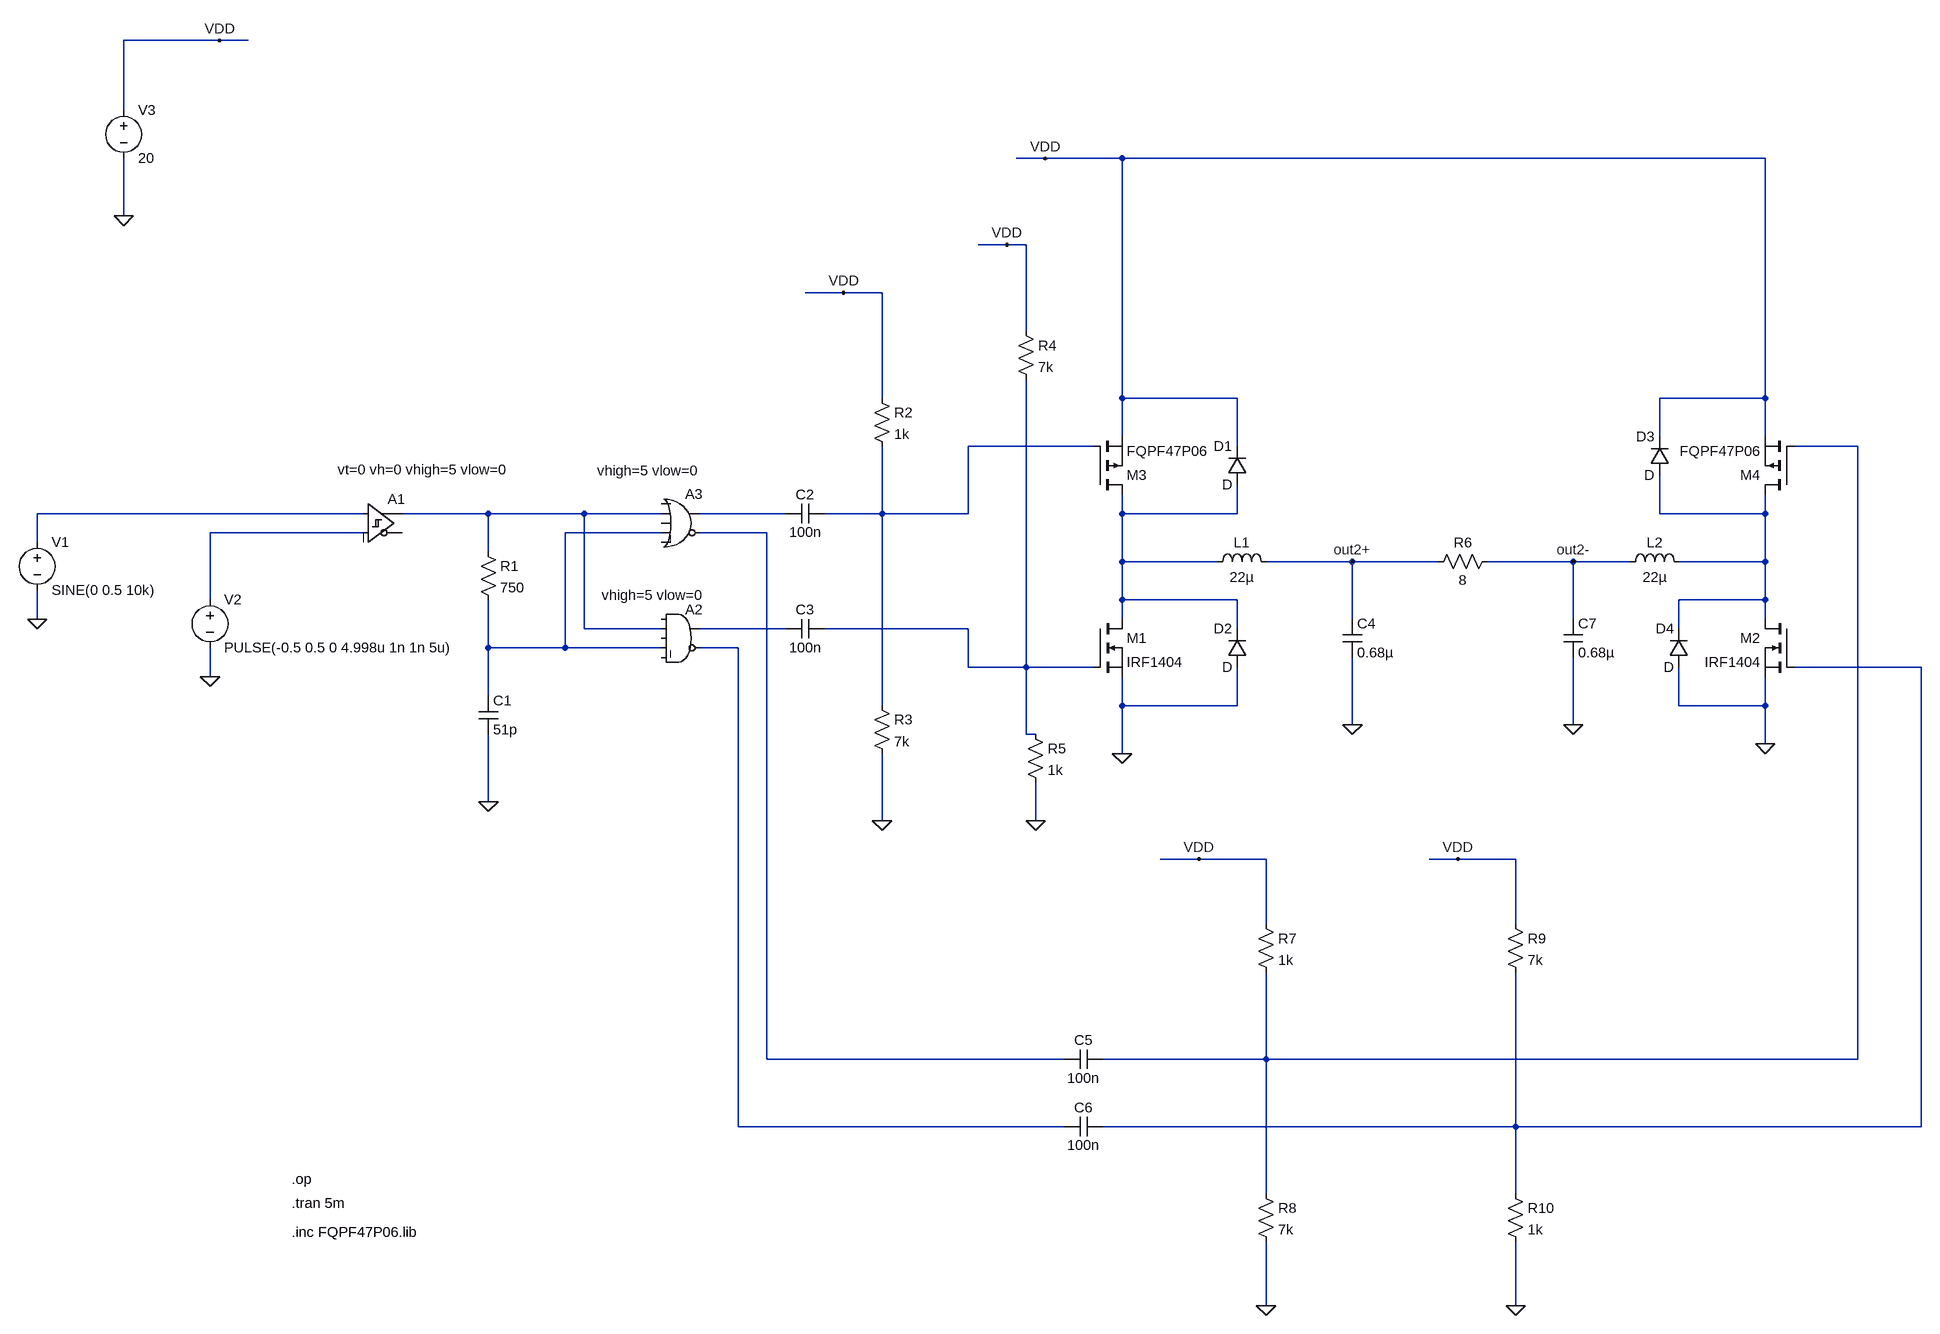
[diagram p0: schematic ClassDAmplifierAlt.asc]
ClassDAmplifierAlt.asc, the LTspice schematic file:
Version 4
SHEET 1 880 1428
WIRE -2784 -864 -2944 -864
WIRE -2736 -864 -2784 -864
WIRE -2944 -704 -2944 -864
WIRE -1408 -624 -1456 -624
WIRE -1280 -624 -1408 -624
WIRE -208 -624 -1280 -624
WIRE -2944 -528 -2944 -624
WIRE -1472 -480 -1520 -480
WIRE -1440 -480 -1472 -480
WIRE -1744 -400 -1808 -400
WIRE -1680 -400 -1744 -400
WIRE -1440 -336 -1440 -480
WIRE -1680 -224 -1680 -400
WIRE -1280 -224 -1280 -624
WIRE -1088 -224 -1280 -224
WIRE -208 -224 -208 -624
WIRE -208 -224 -384 -224
WIRE -1280 -160 -1280 -224
WIRE -384 -160 -384 -224
WIRE -208 -160 -208 -224
WIRE -1328 -144 -1536 -144
WIRE -1088 -144 -1088 -224
WIRE 48 -144 -160 -144
WIRE -2544 -32 -3088 -32
WIRE -2336 -32 -2480 -32
WIRE -2176 -32 -2336 -32
WIRE -2048 -32 -2176 -32
WIRE -1840 -32 -1984 -32
WIRE -1680 -32 -1680 -144
WIRE -1680 -32 -1776 -32
WIRE -1536 -32 -1536 -144
WIRE -1536 -32 -1680 -32
WIRE -1280 -32 -1280 -64
WIRE -1088 -32 -1088 -80
WIRE -1088 -32 -1280 -32
WIRE -384 -32 -384 -96
WIRE -208 -32 -208 -64
WIRE -208 -32 -384 -32
WIRE -2544 0 -2800 0
WIRE -2048 0 -2208 0
WIRE -1872 0 -1984 0
WIRE -3088 16 -3088 -32
WIRE -2336 32 -2336 -32
WIRE -1280 48 -1280 -32
WIRE -1120 48 -1280 48
WIRE -896 48 -1040 48
WIRE -752 48 -896 48
WIRE -528 48 -672 48
WIRE -432 48 -528 48
WIRE -208 48 -208 -32
WIRE -208 48 -352 48
WIRE -2800 112 -2800 0
WIRE -1280 112 -1280 48
WIRE -1088 112 -1280 112
WIRE -208 112 -208 48
WIRE -208 112 -352 112
WIRE -3088 144 -3088 96
WIRE -1280 144 -1280 112
WIRE -896 144 -896 48
WIRE -528 144 -528 48
WIRE -208 144 -208 112
WIRE -2176 160 -2176 -32
WIRE -2048 160 -2176 160
WIRE -1840 160 -1984 160
WIRE -1536 160 -1776 160
WIRE -1088 160 -1088 112
WIRE -352 160 -352 112
WIRE -2336 192 -2336 112
WIRE -2208 192 -2208 0
WIRE -2208 192 -2336 192
WIRE -2048 192 -2208 192
WIRE -1920 192 -1984 192
WIRE -1536 224 -1536 160
WIRE -1440 224 -1440 -256
WIRE -1440 224 -1536 224
WIRE -1328 224 -1440 224
WIRE 160 224 -160 224
WIRE -2800 240 -2800 192
WIRE -2336 272 -2336 192
WIRE -1680 288 -1680 -32
WIRE -1280 288 -1280 240
WIRE -1088 288 -1088 224
WIRE -1088 288 -1280 288
WIRE -352 288 -352 224
WIRE -208 288 -208 240
WIRE -208 288 -352 288
WIRE -896 320 -896 208
WIRE -528 320 -528 208
WIRE -1440 336 -1440 224
WIRE -1424 336 -1440 336
WIRE -208 352 -208 288
WIRE -1280 368 -1280 288
WIRE -2336 448 -2336 336
WIRE -1680 480 -1680 368
WIRE -1424 480 -1424 416
WIRE -1152 544 -1216 544
WIRE -1040 544 -1152 544
WIRE -720 544 -768 544
WIRE -624 544 -720 544
WIRE -1040 704 -1040 544
WIRE -624 704 -624 544
WIRE -1872 976 -1872 0
WIRE -1376 976 -1872 976
WIRE -1040 976 -1040 784
WIRE -1040 976 -1312 976
WIRE 48 976 48 -144
WIRE 48 976 -1040 976
WIRE -1920 1088 -1920 192
WIRE -1376 1088 -1920 1088
WIRE -624 1088 -624 784
WIRE -624 1088 -1312 1088
WIRE 160 1088 160 224
WIRE 160 1088 -624 1088
WIRE -1040 1200 -1040 976
WIRE -624 1200 -624 1088
WIRE -1040 1408 -1040 1280
WIRE -624 1408 -624 1280
FLAG -2800 240 0
FLAG -3088 144 0
FLAG -2336 448 0
FLAG -1280 368 0
FLAG -1408 -624 VDD
FLAG -1424 480 0
FLAG -1680 480 0
FLAG -1744 -400 VDD
FLAG -1472 -480 VDD
FLAG -896 320 0
FLAG -528 320 0
FLAG -208 352 0
FLAG -1040 1408 0
FLAG -624 1408 0
FLAG -1152 544 VDD
FLAG -720 544 VDD
FLAG -896 48 out2+
FLAG -528 48 out2-
FLAG -2944 -528 0
FLAG -2784 -864 VDD
SYMBOL Digital\\diffschmitt -2544 -80 R0
WINDOW 3 -43 -25 Left 2
SYMATTR Value vt=0 vh=0 vhigh=5 vlow=0
SYMATTR InstName A1
SYMBOL voltage -3088 0 R0
WINDOW 123 0 0 Left 0
WINDOW 39 0 0 Left 0
SYMATTR InstName V1
SYMATTR Value SINE(0 0.5 10k)
SYMBOL voltage -2800 96 R0
WINDOW 123 0 0 Left 0
WINDOW 39 0 0 Left 0
SYMATTR InstName V2
SYMATTR Value PULSE(-0.5 0.5 0 4.998u 1n 1n 5u)
SYMBOL Digital\\and -2016 112 R0
WINDOW 3 -131 -8 Left 2
SYMATTR Value vhigh=5 vlow=0
SYMATTR InstName A2
SYMBOL Digital\\or -2016 -80 R0
WINDOW 3 -139 -23 Left 2
SYMATTR Value vhigh=5 vlow=0
SYMATTR InstName A3
SYMBOL res -2352 16 R0
SYMATTR InstName R1
SYMATTR Value 750
SYMBOL cap -2352 272 R0
SYMATTR InstName C1
SYMATTR Value 51p
SYMBOL cap -1776 -48 R90
WINDOW 0 0 32 VBottom 2
WINDOW 3 32 32 VTop 2
SYMATTR InstName C2
SYMATTR Value 100n
SYMBOL cap -1776 144 R90
WINDOW 0 0 32 VBottom 2
WINDOW 3 32 32 VTop 2
SYMATTR InstName C3
SYMATTR Value 100n
SYMBOL nmos -1328 144 R0
SYMATTR InstName M1
SYMATTR Value IRF1404
SYMBOL res -1696 -240 R0
SYMATTR InstName R2
SYMATTR Value 1k
SYMBOL res -1696 272 R0
SYMATTR InstName R3
SYMATTR Value 7k
SYMBOL res -1456 -352 R0
SYMATTR InstName R4
SYMATTR Value 7k
SYMBOL res -1440 320 R0
SYMATTR InstName R5
SYMATTR Value 1k
SYMBOL ind -1136 64 R270
WINDOW 0 32 56 VTop 2
WINDOW 3 5 56 VBottom 2
SYMATTR InstName L1
SYMATTR Value 22µ
SYMBOL cap -912 144 R0
SYMATTR InstName C4
SYMATTR Value 0.68µ
SYMBOL res -656 32 R90
WINDOW 0 0 56 VBottom 2
WINDOW 3 32 56 VTop 2
SYMATTR InstName R6
SYMATTR Value 8
SYMBOL diode -1072 -80 R180
WINDOW 0 24 64 Left 2
WINDOW 3 24 0 Left 2
SYMATTR InstName D1
SYMBOL diode -1072 224 R180
WINDOW 0 24 64 Left 2
WINDOW 3 24 0 Left 2
SYMATTR InstName D2
SYMBOL cap -1312 960 R90
WINDOW 0 0 32 VBottom 2
WINDOW 3 32 32 VTop 2
SYMATTR InstName C5
SYMATTR Value 100n
SYMBOL cap -1312 1072 R90
WINDOW 0 0 32 VBottom 2
WINDOW 3 32 32 VTop 2
SYMATTR InstName C6
SYMATTR Value 100n
SYMBOL cap -544 144 R0
SYMATTR InstName C7
SYMATTR Value 0.68µ
SYMBOL ind -448 64 R270
WINDOW 0 32 56 VTop 2
WINDOW 3 5 56 VBottom 2
SYMATTR InstName L2
SYMATTR Value 22µ
SYMBOL nmos -160 144 M0
SYMATTR InstName M2
SYMATTR Value IRF1404
SYMBOL res -1056 688 R0
SYMATTR InstName R7
SYMATTR Value 1k
SYMBOL res -1056 1184 R0
SYMATTR InstName R8
SYMATTR Value 7k
SYMBOL res -640 688 R0
SYMATTR InstName R9
SYMATTR Value 7k
SYMBOL res -640 1184 R0
SYMATTR InstName R10
SYMATTR Value 1k
SYMBOL diode -368 -96 R180
WINDOW 0 24 64 Left 2
WINDOW 3 24 0 Left 2
SYMATTR InstName D3
SYMBOL diode -336 224 R180
WINDOW 0 24 64 Left 2
WINDOW 3 24 0 Left 2
SYMATTR InstName D4
SYMBOL pmos -1328 -64 M180
SYMATTR InstName M3
SYMATTR Value FQPF47P06
SYMATTR Prefix X
SYMBOL pmos -160 -64 R180
SYMATTR InstName M4
SYMATTR Value FQPF47P06
SYMATTR Prefix X
SYMBOL voltage -2944 -720 R0
WINDOW 123 0 0 Left 0
WINDOW 39 0 0 Left 0
SYMATTR InstName V3
SYMATTR Value 20
TEXT -2664 1176 Left 2 !.op
TEXT -2664 1216 Left 2 !.tran 5m
TEXT -2664 1264 Left 2 !.inc FQPF47P06.lib

The netlist it stands for:
* ClassDAmplifierAlt.asc
A1 N003 N008 0 0 0 0 N004 0 SCHMITT vt=0 vh=0 vhigh=5 vlow=0
V1 N003 0 SINE(0 0.5 10k)
V2 N008 0 PULSE(-0.5 0.5 0 4.998u 1n 1n 5u)
A2 0 N004 0 N009 0 N013 N011 0 AND vhigh=5 vlow=0
A3 0 N004 0 N009 0 N010 N005 0 OR vhigh=5 vlow=0
R1 N004 N009 750
C1 N009 0 51p
C2 N001 N005 100n
C3 N012 N011 100n
M1 N006 N012 0 0 IRF1404
R2 VDD N001 1k
R3 N001 0 7k
R4 VDD N012 7k
R5 N012 0 1k
L1 N006 out2+ 22µ
C4 out2+ 0 0.68µ
R6 out2- out2+ 8
D1 N006 VDD D
D2 0 N006 D
C5 N002 N010 100n
C6 N014 N013 100n
C7 out2- 0 0.68µ
L2 out2- N007 22µ
M2 N007 N014 0 0 IRF1404
R7 VDD N002 1k
R8 N002 0 7k
R9 VDD N014 7k
R10 N014 0 1k
D3 N007 VDD D
D4 0 N007 D
XM3 N006 N001 VDD FQPF47P06  ; pins D G S
XM4 N007 N002 VDD FQPF47P06  ; pins D G S
V3 VDD 0 20
.model D D
.lib standard.dio
.model NMOS NMOS
.model PMOS PMOS
.lib standard.mos
.op
.tran 5m
.inc FQPF47P06.lib
.backanno
.end